# Altium project RFID_RC632.PrjPCB
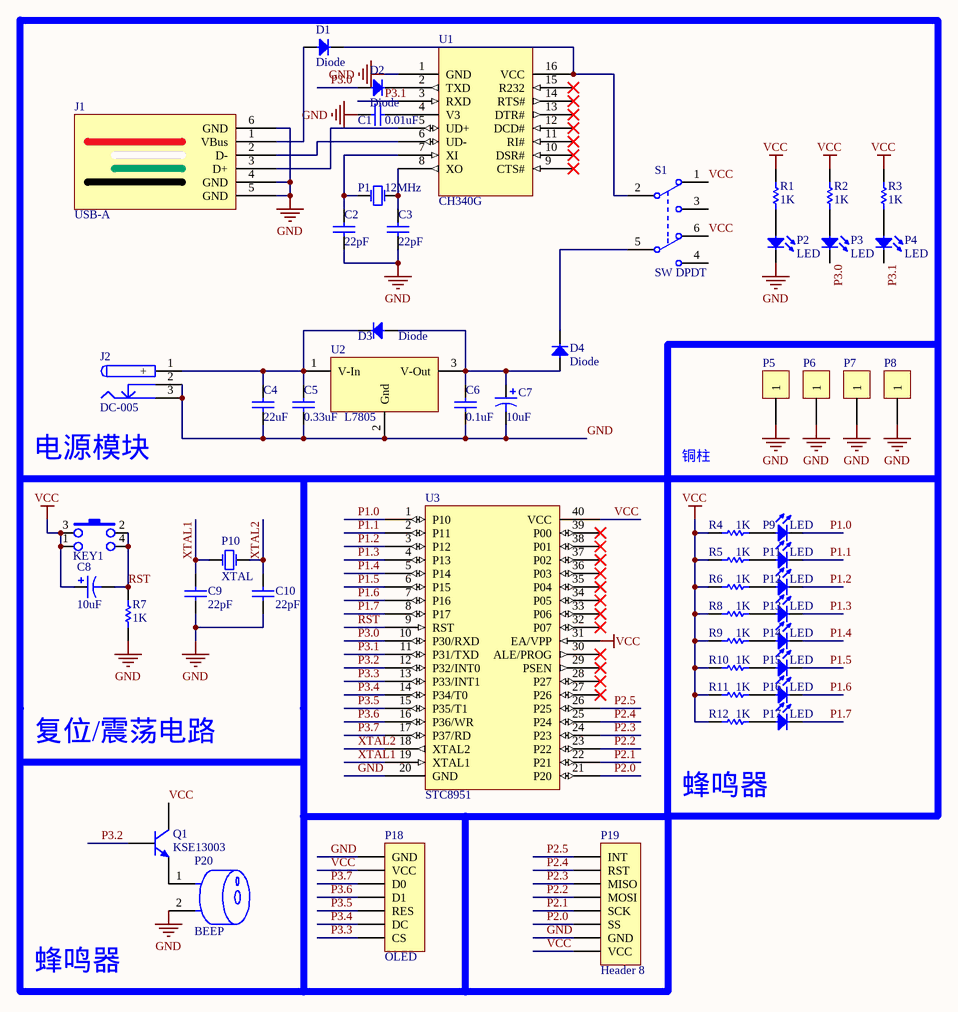
[diagram p0: RFID_RC632.SchDoc]
1 sheet, 54 parts. Net scope: global (net labels, ports and power ports of the same name join across sheets).
Board file: RFID_RC632.PcbDoc

## Sheet RFID_RC632.SchDoc: 多协议的13.56MHz频段RFID系统设计
size A4

### Parts
C1  0.01uF  [普通电容]
C2  22pF  [普通电容]
C3  22pF  [普通电容]
C4  22uF  [普通电容]
C5  0.33uF  [普通电容]
C6  0.1uF  [普通电容]
C7  10uF  [电解电容]
C8  10uF  [电解电容]
C9  22pF  [普通电容]
C10  22pF  [普通电容]
D1  Diode  [Diode]
D2  Diode  [Diode]
D3  Diode  [Diode]
D4  Diode  [Diode]
J1  USB-A  [USB-A]
J2  DC-005  [DC JACK]
KEY1  SW-66B7  [SW-66]  (value not drawn)
P1  12MHz  [晶振]
P2  LED  [LED]
P3  LED  [LED]
P4  LED  [LED]
P5  CU-M3X6-10  [CU-M3X6-10]  (value not drawn)
P6  CU-M3X6-10  [CU-M3X6-10]  (value not drawn)
P7  CU-M3X6-10  [CU-M3X6-10]  (value not drawn)
P8  CU-M3X6-10  [CU-M3X6-10]  (value not drawn)
P9  LED  [LED]
P10  XTAL  [晶振]
P11  LED  [LED]
P12  LED  [LED]
P13  LED  [LED]
P14  LED  [LED]
P15  LED  [LED]
P16  LED  [LED]
P17  LED  [LED]
P18  OLED  [OLED]
P19  Header 8  [RFID]
P20  BEEP  [BEEP]
Q1  KSE13003  [NPN KSE13003]
R1  1K  [电阻]
R2  1K  [电阻]
R3  1K  [电阻]
R4  1K  [电阻]
R5  1K  [电阻]
R6  1K  [电阻]
R7  1K  [电阻]
R8  1K  [电阻]
R9  1K  [电阻]
R10  1K  [电阻]
R11  1K  [电阻]
R12  1K  [电阻]
S1  SW DPDT  [SW DPDT]
U1  CH340G  [CH340G]
U2  L7805  [L7805]
U3  STC8951  [STC8951]

### Blocks framed on the sheet
电源模块: C1-C7 D1-D4 J1 J2 P1-P8 R1-R3 S1 U1 U2

### Nets
GND: C1.1 C2.1 C3.1 C4.1 C5.1 C6.1 C7.2 C9.1 C10.1 J1.4(GND) J1.5(GND) J1.6(GND) J2.2 J2.3(-) P2.2(K) P5.1 P6.1 P7.1 P8.1 P18.1(GND) P19.7(GND) P20.2(-) R7.1 U1.1(GND) U2.2(Gnd) U3.20(GND)
VCC: C8.1 KEY1.1 KEY1.3 P18.2(VCC) P19.8(VCC) Q1.2(C) R1.2 R2.2 R3.2 R4.1 R5.1 R6.1 R8.1 R9.1 R10.1 R11.1 R12.1 S1.1(NC1) S1.6(NC2) U3.31(EA/VPP) U3.40(VCC)
P1.0: P9.2(K) U3.1(P10)
P1.1: P11.2(K) U3.2(P11)
P1.2: P12.2(K) U3.3(P12)
P1.3: P13.2(K) U3.4(P13)
P1.4: P14.2(K) U3.5(P14)
P1.5: P15.2(K) U3.6(P15)
P1.6: P16.2(K) U3.7(P16)
P1.7: P17.2(K) U3.8(P17)
P2.0: P19.6(SS) U3.21(P20)
P2.1: P19.5(SCK) U3.22(P21)
P2.2: P19.4(MOSI) U3.23(P22)
P2.3: P19.3(MISO) U3.24(P23)
P2.4: P19.2(RST) U3.25(P24)
P2.5: P19.1(INT) U3.26(P25)
P3.0: D2.1(A) P3.2(K) U3.10(P30/RXD)
P3.1: P4.2(K) U1.3(RXD) U3.11(P31/TXD)
P3.2: Q1.3(B) U3.12(P32/INT0)
P3.3: P18.7(CS) U3.13(P33/INT1)
P3.4: P18.6(DC) U3.14(P34/T0)
P3.5: P18.5(RES) U3.15(P35/T1)
P3.6: P18.4(D1) U3.16(P36/WR)
P3.7: P18.3(D0) U3.17(P37/RD)
RST: C8.2 KEY1.2 KEY1.4 R7.2 U3.9(RST)
XTAL1: C9.2 P10.1(OSC1) U3.19(XTAL1)
XTAL2: C10.2 P10.2(OSC2) U3.18(XTAL2)
NetC1_2: C1.2 U1.4(V3)
NetC2_2: C2.2 P1.2(OSC2) U1.7(XI)
NetC3_2: C3.2 P1.1(OSC1) U1.8(XO)
NetC4_2: C4.2 C5.2 D3.2(K) J2.1(+) U2.1(V-In)
NetC6_2: C6.2 C7.1 D3.1(A) D4.1(A) U2.3(V-Out)
NetD1_1: D1.1(A) J1.1(VBus)
NetD1_2: D1.2(K) S1.2(COMMON1) U1.16(VCC)
NetD2_2: D2.2(K) U1.2(TXD)
NetD4_2: D4.2(K) S1.5(COMMON2)
NetJ1_2: J1.2(D-) U1.6(UD-)
NetJ1_3: J1.3(D+) U1.5(UD+)
NetP2_1: P2.1(A) R1.1
NetP3_1: P3.1(A) R2.1
NetP4_1: P4.1(A) R3.1
NetP9_1: P9.1(A) R4.2
NetP11_1: P11.1(A) R5.2
NetP12_1: P12.1(A) R6.2
NetP13_1: P13.1(A) R8.2
NetP14_1: P14.1(A) R9.2
NetP15_1: P15.1(A) R10.2
NetP16_1: P16.1(A) R11.2
NetP17_1: P17.1(A) R12.2
NetP20_1: P20.1(+) Q1.1(E)

Not connected (* = marked no-connect by the designer): S1 3(NO1) 4(NO2); U1 9(CTS#)* 10(DSR#)* 11(RI#)* 12(DCD#)* 13(DTR#)* 14(RTS#)* 15(R232)*; U3 27(P26)* 28(P27)* 29(PSEN)* 30(ALE/PROG)* 32(P07)* 33(P06)* 34(P05)* 35(P04)* 36(P03)* 37(P02)* 38(P01)* 39(P00)*

### Notes on the sheet
- 铜柱
- 复位/震荡电路
- 蜂鸣器
- Title
- Size:
- Date:
- A4
- Number:
- Time:
- Revision:
- Sheet
- of
- File:

### Library data of the parts
C1-C6 C9 C10 = Cap: 普通电容
C7 C8 = 电解电容
D1-D4 = Diode: 二极管; Published: 8-Jun-2000; LatestRevisionDate: 17-Jul-2002; LatestRevisionNote: Re-released for DXP Platform.; PackageDocument: Sep-1996; PackageReference: SMC; Publisher: Altium Limited; Code_JEDEC: DO-214-AB
J2 = DC JACK: DC 电源座; Manufacturer: Kycon; Fitted: True
P1 P10 = 晶振
P2-P4 P9 P11-P17 = LED: LED灯
P5-P8 = CU-M3X6-10: 10mm长M3六角铜柱; LatestRevisionDate: 17-Jul-2002; LatestRevisionNote: Re-released for DXP Platform.; Publisher: Altium Limited
P18 = OLED: OLED 0.96寸 SPI; LatestRevisionDate: 17-Jul-2002; LatestRevisionNote: Re-released for DXP Platform.; Publisher: Altium Limited
P19 = RFID: Header, 8-Pin; LatestRevisionDate: 17-Jul-2002; LatestRevisionNote: Re-released for DXP Platform.; Publisher: Altium Limited
P20 = BEEP: 圆形蜂鸣器
Q1 = NPN KSE13003: NPN 三极管; Published: 8-Jun-2000; LatestRevisionDate: 17-Jul-2002; LatestRevisionNote: Re-released for DXP Platform.; PackageReference: TO-226; Publisher: Altium Limited; Code_JEDEC: TO-226-AA
R1-R12 = RES: 电阻
S1 = SW DPDT: 自锁开关 （双刀双掷）; Published: 24-Mar-1999; LatestRevisionDate: 17-Jul-2002; LatestRevisionNote: Re-released for DXP Platform.; PackageReference: SOT23-6; Publisher: Altium Limited
U1 = CH340G: USB to TTL Serial / UART
U2 = L7805: 1.5A Vin:40V(max) Vout:5-24V -55 ~ 150°C LDO稳压器
U3 = STC8951: 51单片机